# EAGLE design pickit4_adapter (EAGLE 9.6.2)
APPROVED: MK; CONTACT: rluttrell@hatchpoint.com (901)605-3388; CREATED_DATE_TIME: 01/30/2022 3:31 PM; DESIGNED: RSL; FILENAME: PICKIT4_Programming_Board.sch; REV: 1.0; SCHEMATIC_TITLE: PICkit4 Adapter Board; SIZE: LET
Assembly variants: A

## Sheet 1 of 2: Revision Table
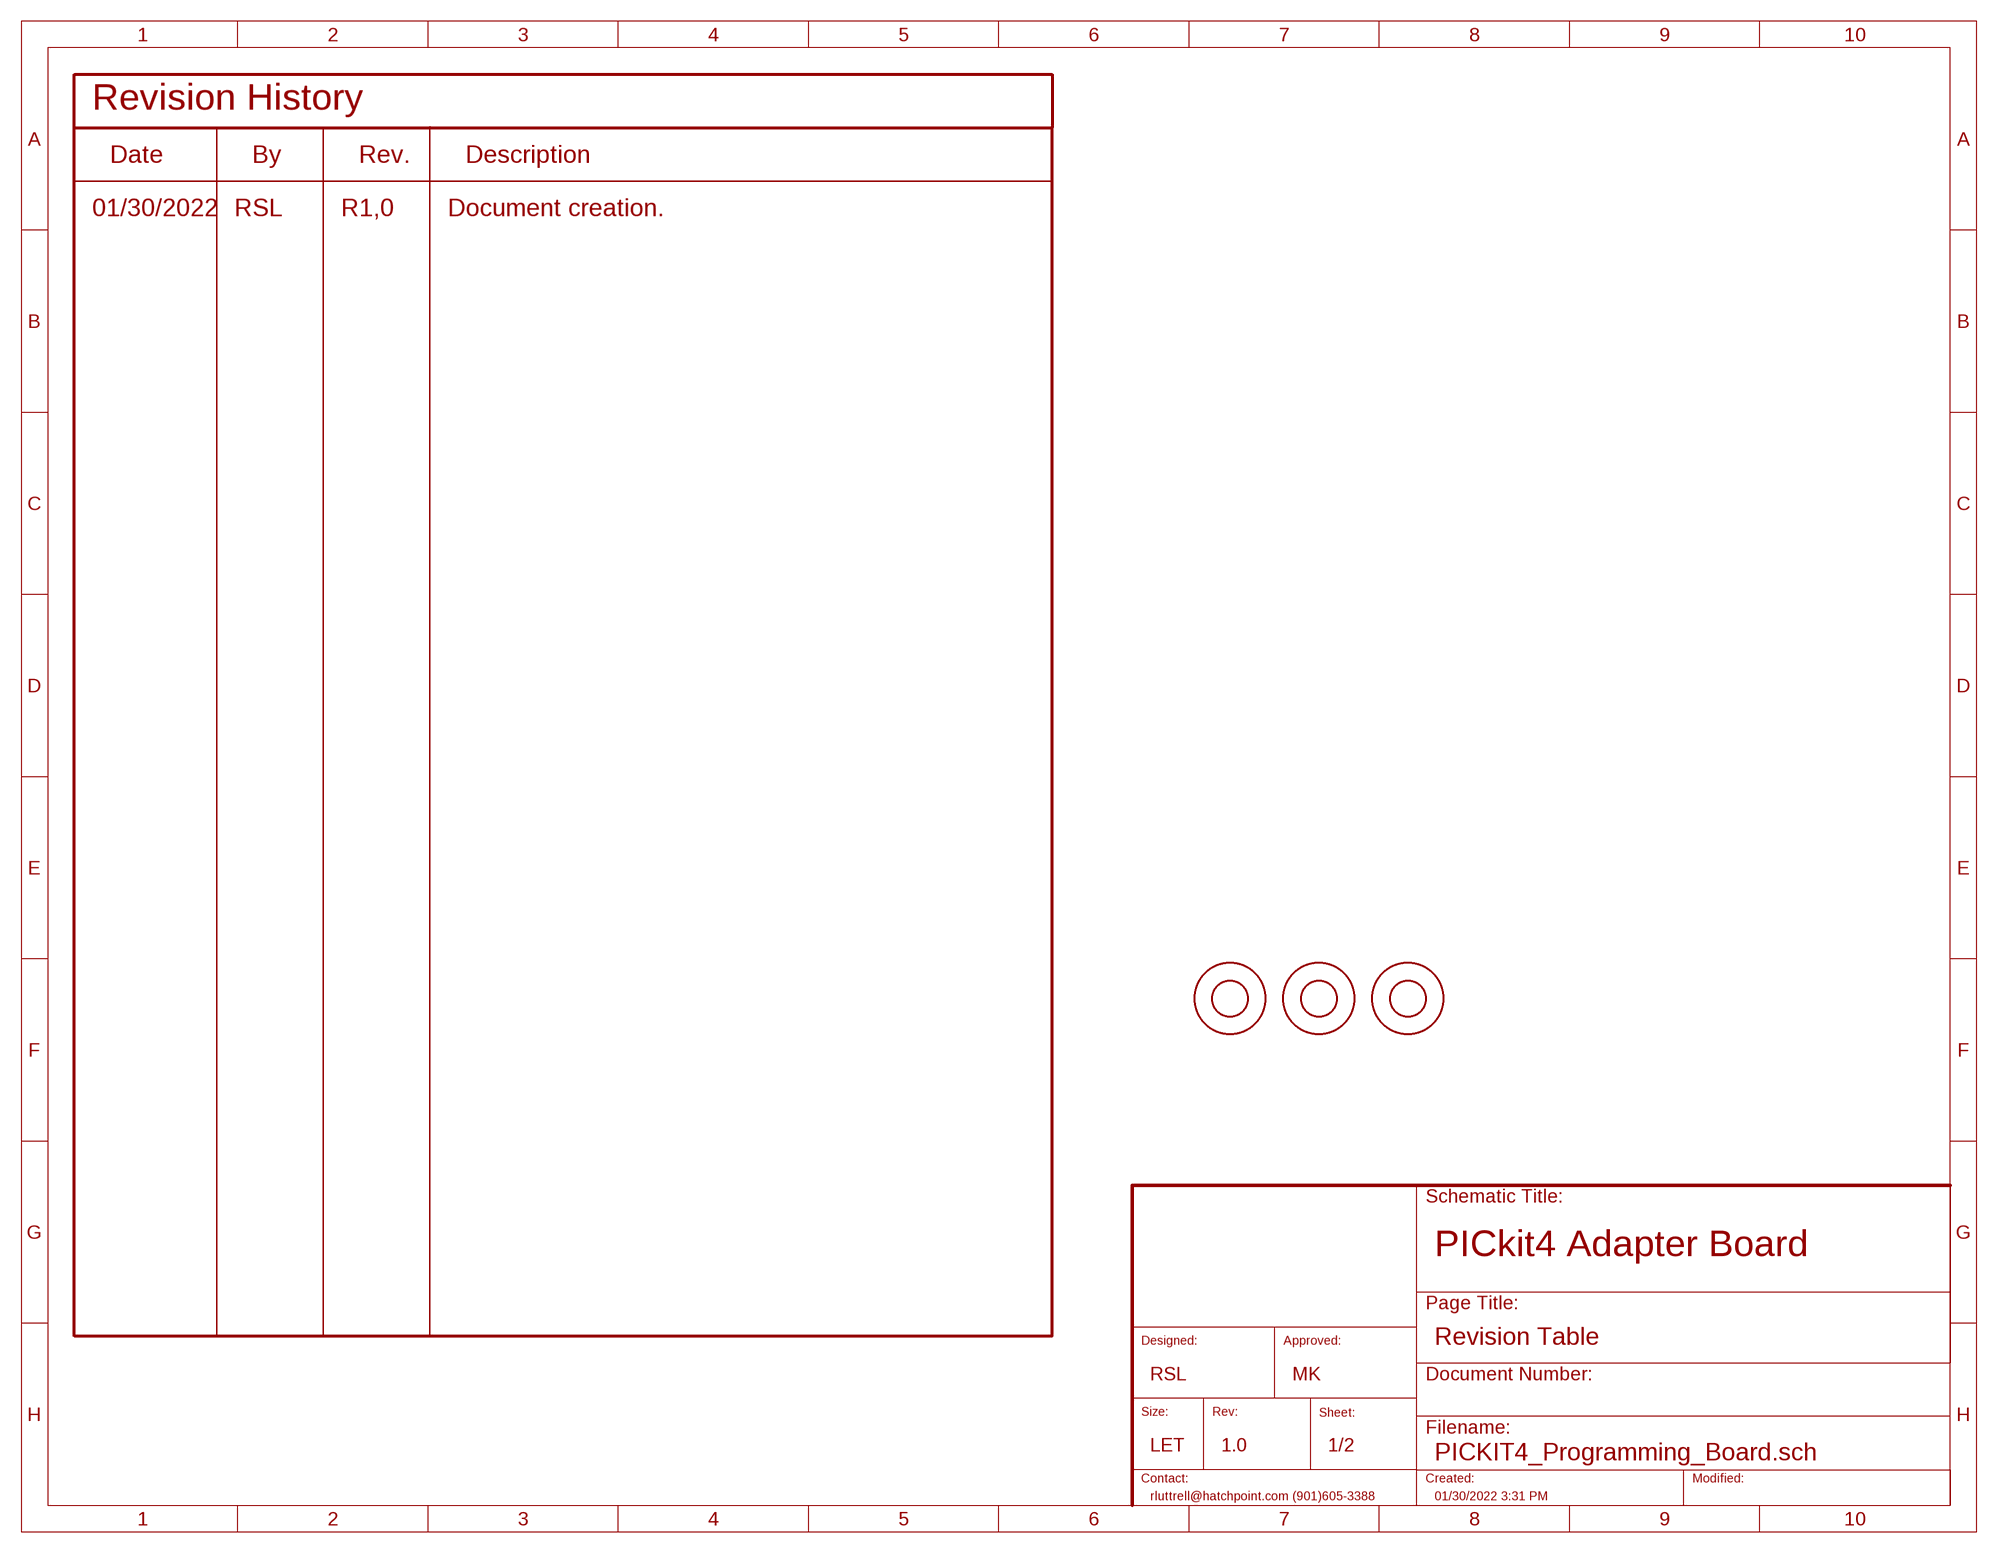
[diagram p0: schematic, sheet 1]

### Parts
FID1  FIDUCIAL_1MM_TOP_BOTTOM  [FIDUCIAL_1MM_TOP_BOTTOM]  (not fitted in variant A)
FID2  FIDUCIAL_1MM_TOP_BOTTOM  [FIDUCIAL_1MM_TOP_BOTTOM]  (not fitted in variant A)
FID3  FIDUCIAL_1MM_TOP_BOTTOM  [FIDUCIAL_1MM_TOP_BOTTOM]  (not fitted in variant A)

### Notes on the sheet
- 01/30/2022 | RSL | R1,0 | Document creation.

## Sheet 2 of 2: Adapter Board
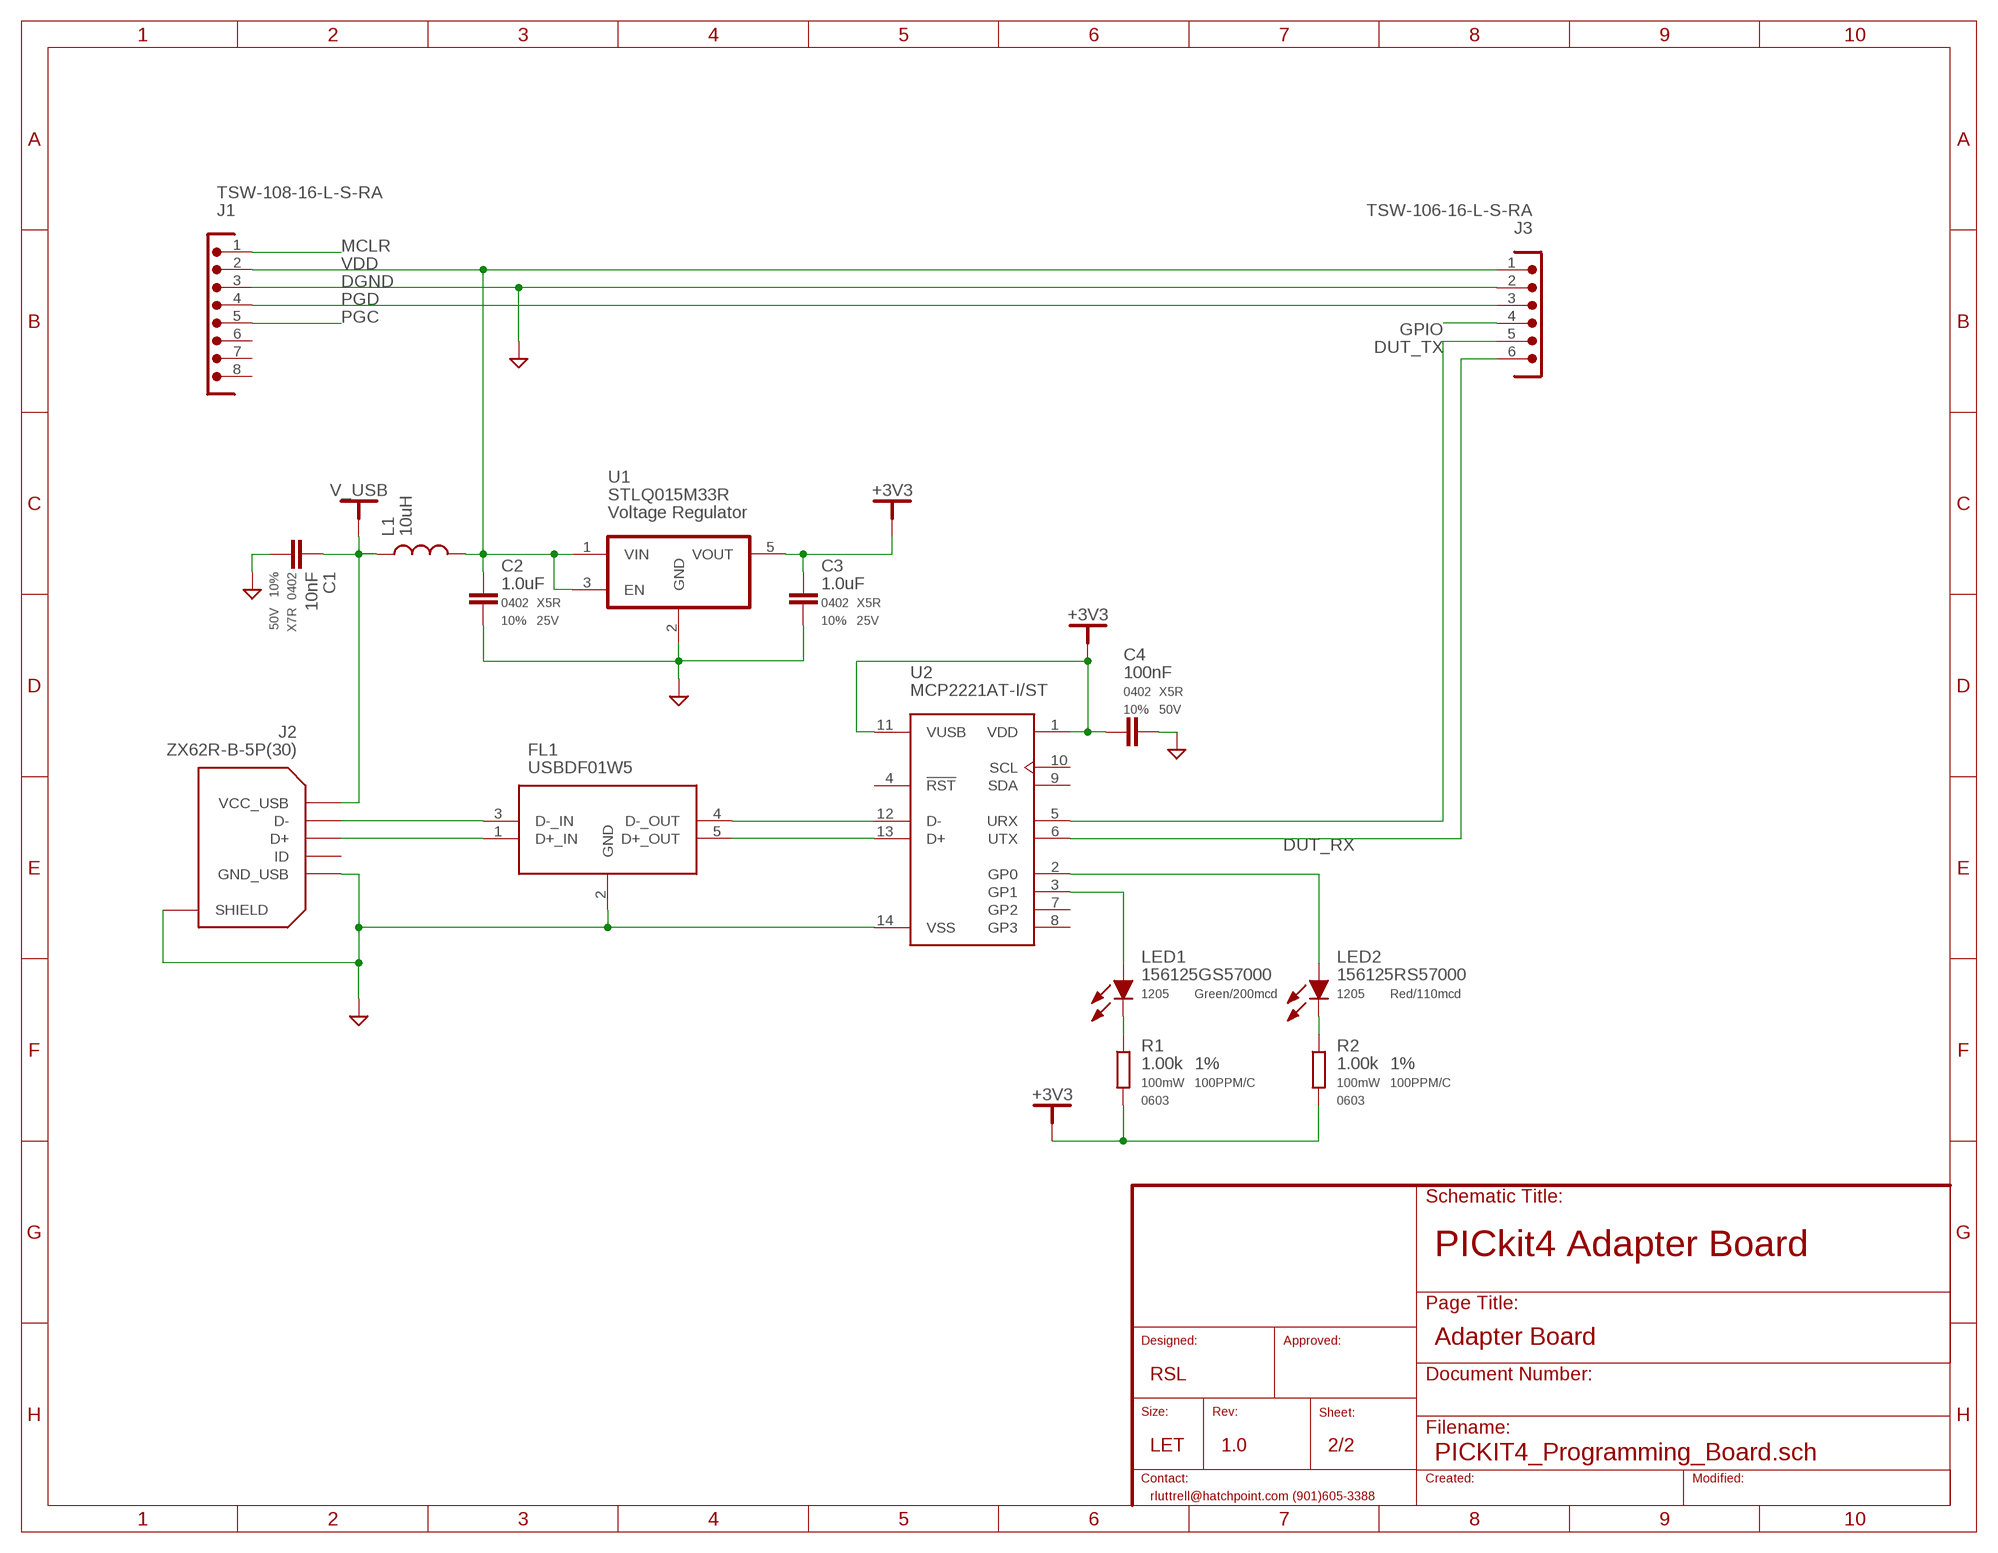
[diagram p1: schematic, sheet 2]

### Parts
C1  10nF  GRM155R71H103KA88D  [CAPC_0402_1005X55N]
C2  1.0uF  GRM155R61E105KA12D  [CAPC_0402_1005X55N]
C3  1.0uF  GRM155R61E105KA12D  [CAPC_0402_1005X55N]
C4  100nF  GRM155R61H104KE19D  [CAPC_0402_1005X55N]
FL1  USBDF01W5  [SOT65P210X110-5N]
J1  TSW-108-16-L-S-RA  [HDR-100MIL-1X8-THRU-RA]
J2  ZX62R-B-5P(30)  [ZX62R-B-5P(30)]
J3  TSW-106-16-L-S-RA  [HDR-100MIL-1X6-THRU-RA]
L1  10uH  LB1608T100M  [INDC1608X90N]
LED1  156125GS57000  [LEDC3212X120N]
LED2  156125RS57000  [LEDC3212X120N]
R1  1.00k  CRCW06031K00FKEAC  [R0603K]
R2  1.00k  CRCW06031K00FKEAC  [R0603K]
U1  STLQ015M33R  [SOT23-5L]
U2  MCP2221AT-I/ST  [SOP65P640X120-14N]

### Nets
+3V3: C3.1 C4.1 R1.2 R2.2 U1.5(VOUT) U2.1(VDD) U2.11(VUSB)
DGND: C1.2 C2.2 C3.2 C4.2 FL1.2(GND) J1.3 J2.5(GND_USB) J2.6(SHIELD) J2.7(SHIELD) J2.8(SHIELD) J2.9(SHIELD) J2.10(SHIELD) J2.11(SHIELD) J3.2 U1.2(GND) U2.14(VSS)
DUT_RX: J3.6 U2.6(UTX)
DUT_TX: J3.5 U2.5(URX)
GPIO: J3.4
MCLR: J1.1
N$1: FL1.4(D-_OUT) U2.12(D-)
N$2: FL1.5(D+_OUT) U2.13(D+)
N$3: FL1.3(D-_IN) J2.2(D-)
N$4: FL1.1(D+_IN) J2.3(D+)
N$6: LED2.2(A) U2.2(GP0)
N$7: LED1.2(A) U2.3(GP1)
N$8: LED1.1(K) R1.1
N$9: LED2.1(K) R2.1
PGC: J1.5
PGD: J1.4 J3.3
V_USB: C1.1 J2.1(VCC_USB) L1.1
VDD: C2.1 J1.2 J3.1 L1.2 U1.1(VIN) U1.3(EN)
Unconnected: J1.6 J1.7 J1.8 J2.4(ID) U2.4(!RST) U2.7(GP2) U2.8(GP3) U2.9(SDA) U2.10(SCL)

## Library data of the parts
C1 = HatchPoint-Capacitors:GRM?*; DESCRIPTION: Murata 0402 Ceramic Capacitor; MANUFACTURER: Murata; PACKAGE: 0402; TOL: 10%; TYPE: X7R; VDC: 50V
C2 C3 = HatchPoint-Capacitors:GRM?*; DESCRIPTION: Murata 0402 Ceramic Capacitor; MANUFACTURER: Murata; PACKAGE: 0402; TOL: 10%; TYPE: X5R; VDC: 25V
C4 = HatchPoint-Capacitors:GRM?*; DESCRIPTION: Murata 0402 Ceramic Capacitor; MANUFACTURER: Murata; PACKAGE: 0402; TOL: 10%; TYPE: X5R; VDC: 50V
FID1-FID3 = HatchPoint:FIDUCIAL
FL1 = HatchPoint-ST:USBDF0*W5: STMicroelectronics USBDF Series, EMI Filter 30 MHz 1 GHz (Radiated), 450 kHz 30MHz (Conducted) SOT323 Source: Datasheet <https://www.st.com/resource/en/datasheet/usbdf.pdf>; DESCRIPTION: 15 Ohm USB terminator; MANUFACTURER: ST
J1 = HatchPoint-Samtec:TSW-108-16-L-S-RA
J2 = HatchPoint-USB:ZX62?*: USB Connectors MICRO B RECEPT RA SMT MID MNT Source: Datasheet <https://componentsearchengine.com/Datasheets/1/ZX62M-B-5P.pdf>
J3 = HatchPoint-Samtec:TSW-106-16-L-S-RA
L1 = HatchPoint-Inductors:LB1608T100M: Ind Chip Wirewound 10uH 20% 2.52MHz Ferrite 60mA 0603 T/R Check prices <https://pricing.snapeda.com/parts/LB1608T100M/Taiyo%20Yuden/view-part?ref=eda>; AVAILABILITY: Good; DESCRIPTION: 10µH Unshielded Wirewound Inductor 60mA 700mOhm 0603 (1608 Metric); IDC: 60mA; MF: Taiyo Yuden; MP: LB1608T100M; PACKAGE: 0603; R: 700mOhm
LED1 = HatchPoint-Wurtz:156125: 3.9 V Green LED 1205 SMD, Wurth Elektronik WL-SMRD 156125GS57000 Source: Datasheet <https://docs.rs-online.com/0ef6/0900766b816634b7.pdf>; DESCRIPTION: Green/200mcd; MANUFACTURER_NAME: Wurth Electronics; PACKAGE: 1205
LED2 = HatchPoint-Wurtz:156125: 3.9 V Green LED 1205 SMD, Wurth Elektronik WL-SMRD 156125GS57000 Source: Datasheet <https://docs.rs-online.com/0ef6/0900766b816634b7.pdf>; DESCRIPTION: Red/110mcd; MANUFACTURER_NAME: Wurth Electronics; PACKAGE: 1205
R1 R2 = HatchPoint-Vishay:CRCW?*: Vishay/Dale SMD Resistor; MF: Vishay; PACKAGE: 0603; PWR_RATE: 100mW; TEMPCO: 100PPM/C; TOLERANCE: 1%; TYPE: Thick Film
U1 = HatchPoint-ST:STLQ015M: LDO Voltage Regulators 150 mA - ultra low quiescent current linear voltage regulator; DESC: Voltage Regulator; MF: STM; MP: STLQ015M33R; VOLTAGE: 3.3V
U2 = HatchPoint-MicrochipTechnology:MCP2221AT-*: USB 2.0 to I2C/UART Protocol Converter Source: Datasheet <http://ww1.microchip.com/downloads/en/devicedoc/20005565b.pdf>; ARROW_PART_NUMBER: MCP2221A-I/ST; ARROW_PRICE-STOCK: https://www.arrow.com/en/products/mcp2221a-ist/microchip-technology?region=nac; DESCRIPTION: USB 2.0 to I2C/UART Protocol Converter; HEIGHT: 1.2mm; MANUFACTURER_NAME: Microchip; MANUFACTURER_PART_NUMBER: MCP2221A-I/ST; MOUSER_PART_NUMBER: 579-MCP2221A-I/ST; MOUSER_PRICE-STOCK: https://www.mouser.co.uk/ProductDetail/Microchip-Technology/MCP2221A-I-ST?qs=ZEMkBHnybREMkqMgzOrcGQ%3D%3D

## Board
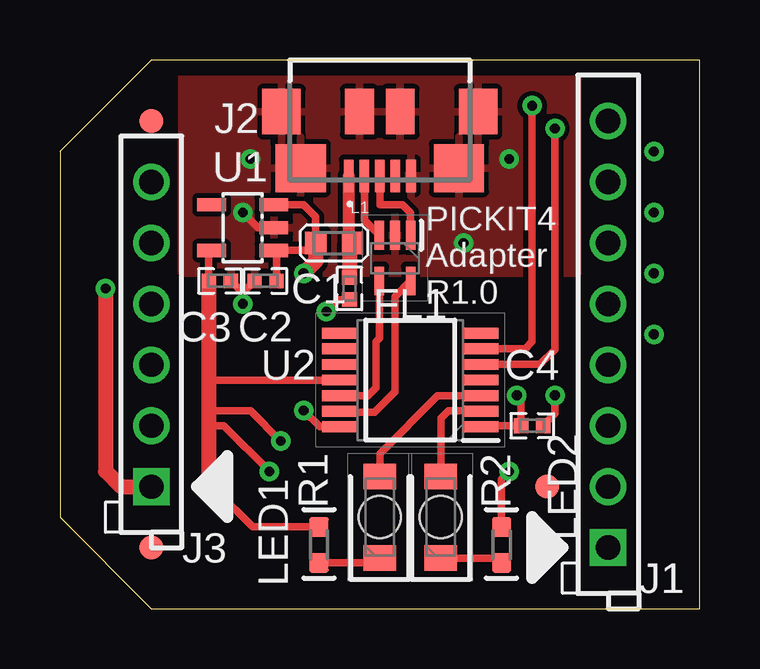
[diagram p2: board, top side]
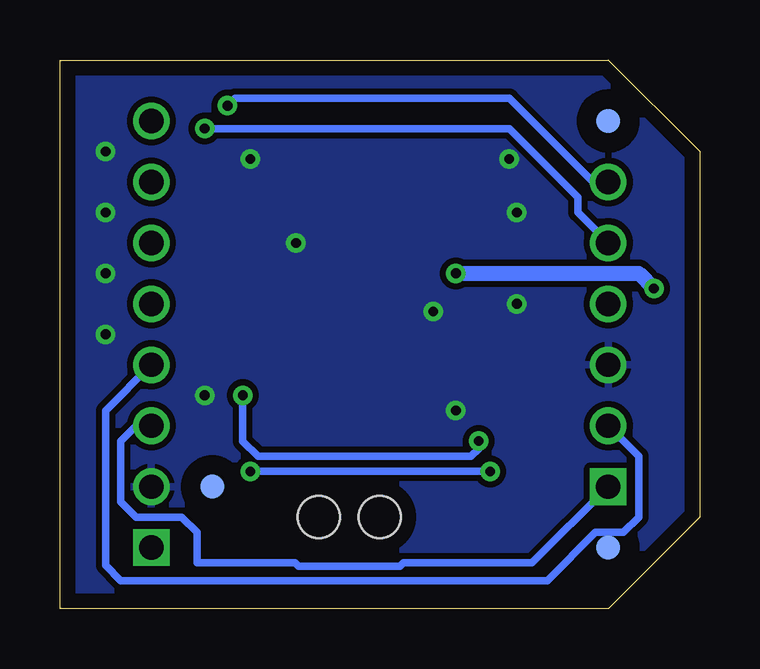
[diagram p3: board, bottom side, seen from below]

Size 26.67 x 22.86 mm. Coordinates in mm from the lower left corner, seen from the top.
Outline: 3.81,0 26.67,0 26.67,22.86 3.81,22.86 0,19.05 0,3.81 3.81,0
Copper layers (1*16): Top 0.035mm / dielectric 1.5mm / Bottom 0.035mm
Design rules "default *": minimum track width 8mil, minimum drill 16mil, track to track 8mil, track to pad 6mil, pad to pad 6mil, via to via 8mil, smd to smd 6mil, copper to edge 25mil, drill to drill 8mil, minimum pad ring 10mil, minimum via ring 8mil, stop-mask expansion 4mil, vias tented up to drill 0mil, thermal gap 8mil

### Footprints (pad centres in the part's own frame; a part is rotated, then mirrored left to right if it is on the bottom)
CAPC_0402_1005X55N = smd 0.6 x 0.62: 1 -0.46,0; 2 0.46,0
FIDUCIAL_1MM_TOP_BOTTOM = smd 1 x 1: 1 0,0 | smd 1 x 1 bottom: 2 0,0
SOT65P210X110-5N = smd 1.2 x 0.4: 1 -0.95,0.65; 2 -0.95,0; 3 -0.95,-0.65; 4 0.95,-0.65; 5 0.95,0.65
HDR-100MIL-1X8-THRU-RA = drill 1.016 square: 1 0,0 | drill 1.016: 2 5.08,0; 3 2.54,0; 4 7.62,0; 5 10.16,0; 6 12.7,0; 7 15.24,0; 8 17.78,0
ZX62R-B-5P(30) = smd 0.4 x 1.35: 1 1.3,4.825; 2 0.65,4.825; 3 0,4.825; 4 -0.65,4.825; 5 -1.3,4.825 | smd 2.1 x 2: 6 -3.3,4.5; 7 3.3,4.5 | smd 1.6 x 1.9: 8 -4.1,2.15; 9 4.1,2.15 | smd 1.2 x 1.9: 10 -0.85,2.15; 11 0.85,2.15
HDR-100MIL-1X6-THRU-RA = drill 1.016 square: 1 0,0 | drill 1.016: 2 5.08,0; 3 2.54,0; 4 7.62,0; 5 10.16,0; 6 12.7,0
INDC1608X90N = smd 0.89 x 0.93: 1 -0.77,0; 2 0.77,0
LEDC3212X120N = smd 1.05 x 1.35: 1 -1.7,0; 2 1.7,0 | hole 1.753: 0,0
R0603K = smd 0.8 x 0.8: 1 0,0; 2 1.5,0
SOT23-5L = smd 0.55 x 1.2: 1 -0.95,-1.3; 2 0,-1.3; 3 0.95,-1.3; 4 0.95,1.3; 5 -0.95,1.3
SOP65P640X120-14N = smd 1.475 x 0.45: 1 -2.938,1.95; 2 -2.938,1.3; 3 -2.938,0.65; 4 -2.938,0; 5 -2.938,-0.65; 6 -2.938,-1.3; 7 -2.938,-1.95; 8 2.938,-1.95; 9 2.938,-1.3; 10 2.938,-0.65; 11 2.938,0; 12 2.938,0.65; 13 2.938,1.3; 14 2.938,1.95

### Placement (x,y rotation side)
C1  12.06,13.34 270 top
C2  8.57,13.65 180 top
C3  6.67,13.65 0 top
C4  19.68,7.62 0 top
FID1  3.81,2.54 0 top
FID2  3.81,20.32 0 top
FID3  20.32,5.08 0 top
FL1  13.97,14.61 270 top
J1  22.86,2.54 90 top
J2  13.34,22.86 180 top
J3  3.81,5.08 90 top
L1  11.43,15.24 180 top
LED1  13.34,3.81 90 top
LED2  15.88,3.81 90 top
R1  10.79,1.91 90 top
R2  18.41,1.91 90 top
U1  7.62,15.88 90 top
U2  14.61,9.53 180 top

### Tracks (layer width: path | path; a pad name or v marks a point on that pad's centre or on a via)
+3V3  (via drill 0.41)
  Top 0.305: C3.1 6.21,14.81 U1.5 | U2.1 17.59,7.62 C4.1 19.23,8.71 v19.05,8.89 | 6.21,9.53 U2.11 | R1.2 8.03,3.4 6.51,4.92 | v18.73,5.71 18.41,5.4 R2.2 | v8.73,5.71 6.83,7.62 6.21,7.62 | v9.21,6.99 7.94,8.26 6.21,8.26
  Top 0.635: C3.1 6.21,9.53 6.21,8.26 6.21,7.62 6.21,5.22 6.51,4.92
  Bottom 0.305: v18.73,5.71 v8.73,5.71 | v9.21,6.99 9.21,6.67 9.53,6.35 18.41,6.35 19.05,6.99 v19.05,8.89
DGND  (via drill 0.41)
  Top 0.305: C4.2 20.64,8.11 v20.64,8.89 | U2.14 10.84,7.58 v10.16,8.26 | C1.2 11.61,12.88 v11.11,12.38 | C2.2 7.62,13.16 | C3.2 7.62,13.16 | 7.62,13.16 v7.62,12.7 | U1.2 8.26,15.88 v7.62,16.51
  other vias: 18.73,18.73 16.83,15.24 7.94,18.73 24.77,19.05 24.77,16.51 24.77,13.97 24.77,11.43
  pour Bottom (isolate 0.254, rank 3): -2.54,25.4 27.94,25.4 27.94,-2.54 -2.54,-2.54
  pour Top: 5.08,25.4 5.08,13.97 21.59,13.97 21.59,25.4
DUT_RX  (via drill 0.41)
  Top 0.305: U2.6 19.4,10.82 19.68,11.11 v19.68,20.95
  Bottom 0.305: v19.68,20.95 19.37,21.27 7.94,21.27 4.45,17.78 J3.6
DUT_TX  (via drill 0.41)
  Top 0.305: v20.64,20 20.64,10.79 20.02,10.18 U2.5
  Bottom 0.305: J3.5 5.08,16.51 5.08,17.14 7.94,20 v20.64,20
N$1
  Top 0.305: FL1.4 13.32,11.26 13.18,11.11 13.18,9.21 12.84,8.88 U2.12
N$2
  Top 0.305: U2.13 11.71,8.19 13.12,8.19 13.97,9.04 13.97,13.01 FL1.5
N$3
  Top 0.305: J2.2 12.7,18.02 12.7,16.18 FL1.3
N$4
  Top 0.305: J2.3 13.34,16.83 14.29,16.83 14.62,16.5 FL1.1
N$6
  Top 0.305: LED2.2 15.88,7.94 16.19,8.26 17.51,8.26 U2.2
N$7
  Top 0.305: LED1.2 13.34,6.46 15.75,8.88 U2.3
N$8
  Top 0.305: LED1.1 13.13,1.91 R1.1
N$9
  Top 0.305: LED2.1 18.21,2.11 R2.1
PGD
  Bottom 0.305: J3.3 2.54,6.35 2.54,3.81 3.17,3.17 4.34,3.17 6.35,1.17 24.13,1.17 24.77,1.8 24.77,8.26 J1.4
V_USB
  Top 0.305: 12.06,15.11 L1.1
  Top 0.508: J2.1 12.04,15.13 12.06,15.11
  Top 0.635: 12.06,15.11 C1.1
VDD  (via drill 0.41)
  Top 0.305: C2.1 9.03,14.81 U1.1 10.35,14.93 L1.2 10.66,16.33 10.16,16.82 U1.3
  Top 0.635: v1.91,13.34 1.91,5.71 2.54,5.08 J3.1 | L1.2 10.66,14.47 v10.16,13.97
  Bottom 0.305: J1.2 23.5,7.62 24.13,6.99 24.13,4.45 23.5,3.81 21.59,3.81 20.95,3.17 20.95,1.91 16.86,1.91 16.72,1.76 12.49,1.76 12.35,1.91 6.99,1.91 J3.1
  Bottom 0.635: v10.16,13.97 2.54,13.97 v1.91,13.34

### Text on the board
tPlace: PICKIT4 / Adapter / R1.0